# Altium project LoadCellAmplifier.PrjPcb
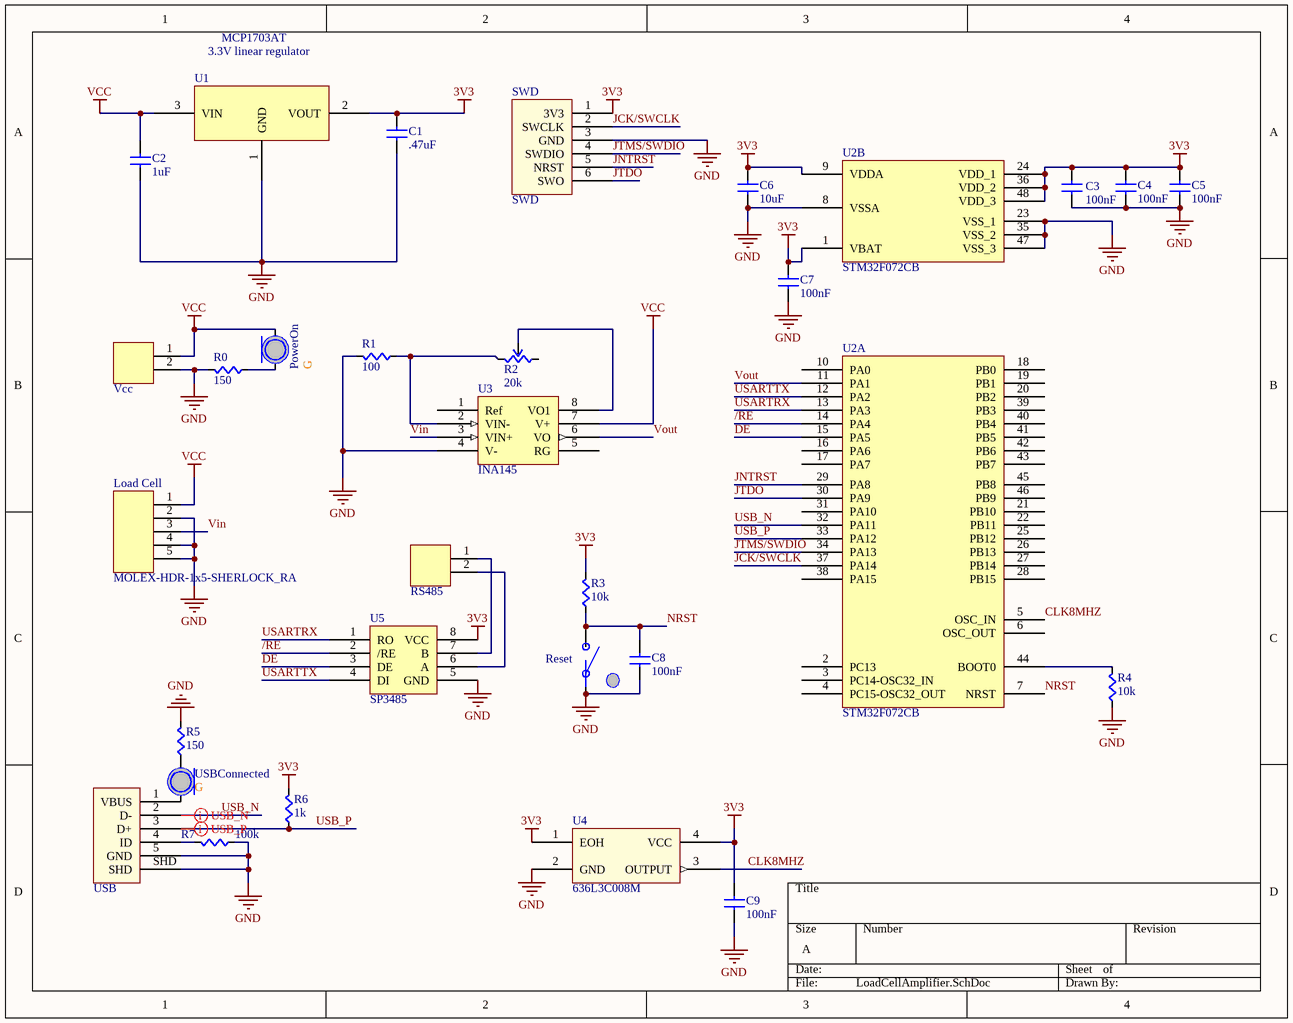
[diagram p0: LoadCellAmplifier.SchDoc]
1 sheet, 30 parts. Net scope: global (net labels, ports and power ports of the same name join across sheets).
Board file: Load_Cell_Amplifier.PcbDoc

## Sheet LoadCellAmplifier.SchDoc
size A

### Parts
C1  value .47uF  [CAPC0603]  (hidden comment: Cap)
C2  value 1uF  [CAPC0603]  (hidden comment: Cap)
C3  value 100nF  [CAPC0603]  (hidden comment: Cap)
C4  value 100nF  [CAPC0603]  (hidden comment: Cap)
C5  value 100nF  [CAPC0603]  (hidden comment: Cap)
C6  value 10uF  [CAPC1206]  (hidden comment: Cap)
C7  value 100nF  [CAPC0603]  (hidden comment: Cap)
C8  value 100nF  [CAPC0603]  (hidden comment: Cap)
C9  value 100nF  [CAPC0603]  (hidden comment: Cap)
Load_Cell  MOLEX-HDR-1x5-SHERLOCK_RA  [MOLEX-HDR-1X5-SHERLOCK- RA]
PowerOn  Color: G  [LED0805]  (hidden comment: LED)
R0  value 150  [RES0603]  (hidden comment: Res)
R1  value 100  [RES0603]  (hidden comment: Res)
R2  value 20k  [ST4ETA103]  (hidden comment: Pot)
R3  value 10k  [RES0603]  (hidden comment: Res)
R4  value 10k  [RES0603]  (hidden comment: Res)
R5  value 150  [RES0603]  (hidden comment: Res)
R6  value 1k  [RES0603]  (hidden comment: Res)
R7  value 100k  [RES0603]  (hidden comment: Res)
Reset  Button  [PTS645xxxxSMTR92]  (value not drawn)
RS485  2-pin Horz Sherlock  [MOLEX-HDR-1X2-SHERLOCK-HORZ]  (value not drawn)
SWD  SWD  [SWD_STM32]
U1  MCP1703AT  [MCP1703AT-xx02EMB]
U2  STM32F072CB  [STM32F072CB]  (parts A,B of 2)
U3  INA145  [INA145]
U4  636L3C008M  [636L3C]
U5  SP3485  [SP3485]
USB  USB Micro  [10118192-0001LF]  (value not drawn)
USBConnected  Color: G  [LED0805]  (hidden comment: LED)
Vcc  2-pin Horz Sherlock  [MOLEX-HDR-1X2-SHERLOCK-HORZ]  (value not drawn)

### Nets
3V3: C1.1(A) C3.1(A) C4.1(A) C5.1(A) C6.2(B) C7.1(A) C9.1(A) R3.1(A) R6.1(A) SWD.1(3V3) U1.2(VOUT) U2.1(VBAT) U2.9(VDDA) U2.24(VDD_1) U2.36(VDD_2) U2.48(VDD_3) U4.1(EOH) U4.4(VCC) U5.8(VCC)
GND: C1.2(B) C2.2(B) C3.2(B) C4.2(B) C5.2(B) C6.1(A) C7.2(B) C8.2(B) C9.2(B) Load_Cell.2 Load_Cell.4 Load_Cell.5 R0.1(A) R1.1(A) R4.2(B) R5.1(A) R7.2(B) Reset.A SWD.3(GND) U1.1(GND) U2.8(VSSA) U2.23(VSS_1) U2.35(VSS_2) U2.47(VSS_3) U3.4(V-) U4.2(GND) U5.5(GND) USB.5(GND) USB.SHD Vcc.2
VCC: C2.1(A) Load_Cell.1 PowerOn.A U1.3(VIN) U3.7(V+) Vcc.1
/RE: U2.14(PA4) U5.2(/RE)
CLK8MHZ: U2.5(OSC_IN) U4.3(OUTPUT)
DE: U2.15(PA5) U5.3(DE)
JCK/SWCLK: SWD.2(SWCLK) U2.37(PA14)
JNTRST: SWD.5(NRST) U2.29(PA8)
JTDO: SWD.6(SWO) U2.30(PA9)
JTMS/SWDIO: SWD.4(SWDIO) U2.34(PA13)
NRST: C8.1(A) R3.2(B) Reset.B U2.7(NRST)
USARTRX: U2.13(PA3) U5.1(RO)
USARTTX: U2.12(PA2) U5.4(DI)
USB_N: U2.32(PA11) USB.2(D-)
USB_P: R6.2(B) U2.33(PA12) USB.3(D+)
Vin: Load_Cell.3 U3.3(VIN+)
Vout: U2.11(PA1) U3.6(VO)
NetPowerOn_C: PowerOn.C R0.2(B)
NetR1_2: R1.2(B) R2.1 U3.2(VIN-)
NetR2_3: R2.3 U3.8(VO1)
NetR4_1: R4.1(A) U2.44(BOOT0)
NetR5_2: R5.2(B) USBConnected.C
NetR7_1: R7.1(A) USB.4(ID)
NetRS485_1: RS485.1 U5.7(B)
NetRS485_2: RS485.2 U5.6(A)
NetUSB_1: USB.1(VBUS) USBConnected.A

Not connected (* = marked no-connect by the designer): R2 2; U2 2(PC13) 3(PC14-OSC32_IN) 4(PC15-OSC32_OUT) 6(OSC_OUT) 10(PA0) 16(PA6) 17(PA7) 18(PB0) 19(PB1) 20(PB2) 21(PB10) 22(PB11) 25(PB12) 26(PB13) 27(PB14) 28(PB15) 31(PA10) 38(PA15) 39(PB3) 40(PB4) 41(PB5) 42(PB6) 43(PB7) 45(PB8) 46(PB9); U3 1(Ref) 5(RG)

### Layout directives
differential pair: USB_N, USB_P

### Notes on the sheet
- 3.3V linear regulator

### Library data of the parts
Load_Cell = MOLEX-HDR-1x5-SHERLOCK_RA: Header, Molex, 2mm Pitch Sherlock Header, Single Row, Vertical, 5 Circuits, Length 3.3mm, 0353620550; Manufacturer Part Number: 0353630560; Supplier Part Number: WM18934-ND; Supplier: Digikey; Manufacturer: Molex
R2 = Potentiometer: Supplier 1: Digi-Key; Supplier Part Number 1: ST4ETA203CT-ND
Reset = Button: SPST Button; Supplier 1: Digi-Key; Supplier Part Number 1: CKN9087CT-ND
RS485 Vcc = MOLEX-HDR-1x2-SHERLOCK_RA: Header, Molex, 2mm Pitch Sherlock Header, Single Row, Horizontal, 2 Circuits, Length 3.3mm,  0353630260; Manufacturer: Molex Inc; Manufacturer Part Number: 0353630260; Supplier Part Number: WM18931-ND; Supplier: Digi-Key
SWD = SWD_STM32: SWD connector matching the pinout on STM Discovery Boards
U1 = MCP1703AT: 250 mA, 16V, Low Quiescent Current LDO Regulator; pin to pad: 2>3 3>2; Supplier 1: Digi-Key; Supplier Part Number 1: MCP1703AT-3302E/CBCT-ND
U2 = STM32F072CB: MCU 32BIT 128KB FLASH 48LQFP; Supplier 1: Digi-Key; Supplier Part Number 1: 497-14645-ND
U3 = INA145: Diff Amp; Supplier 1: Digi-Key; Supplier Part Number 1: INA145UA-ND
U4 = 636L3C: HCMOS/TTL Clock Oscillator; Supplier 1: Digi-Key; Supplier Part Number 1: CTX1005CT-ND
U5 = SP3485: IC TXRX RS485 HALF DUPLEX 8NSOIC; Supplier 1: Digi-Key; Supplier Part Number 1: 1016-1817-1-ND
USB = USB Micro: USB Mini B Metal Shield SMT; Supplier 1: Digi-Key; Supplier Part Number 1: 609-4613-1-ND
C1-C9 = Cap: Supplier 1: Digi-Key
  C1: Supplier Part Number 1: 445-7465-1-ND
  C2: Supplier Part Number 1: 1276-1860-1-ND
  C3-C5 C7-C9: Supplier Part Number 1: 1276-1000-1-ND
  C6: Supplier Part Number 1: 1276-2876-1-ND
PowerOn USBConnected = LED: Supplier 1: Digi-Key
  PowerOn: Supplier Part Number 1: 754-1122-1-ND
  USBConnected: Supplier Part Number 1: 160-1414-1-ND
R0 R1 R3-R7 = Res: Supplier 1: Digi-Key
  R0 R3 R4: Supplier Part Number 1: RMCF0603JT10K0CT-ND
  R1: Supplier Part Number 1: RHM100CFCT-ND
  R5: Supplier Part Number 1: RNCP0603FTD150RCT-ND
  R6: Supplier Part Number 1: RMCF0603JT1K00CT-ND
  R7: Supplier Part Number 1: RMCF0603JT100KCT-ND